# Altium schematic sheet ADC.SchDoc
size A3; Author: Jean Callus; Engineer: Jean Callus; Organization: RATON; Revision: 0; SheetNumber: 2
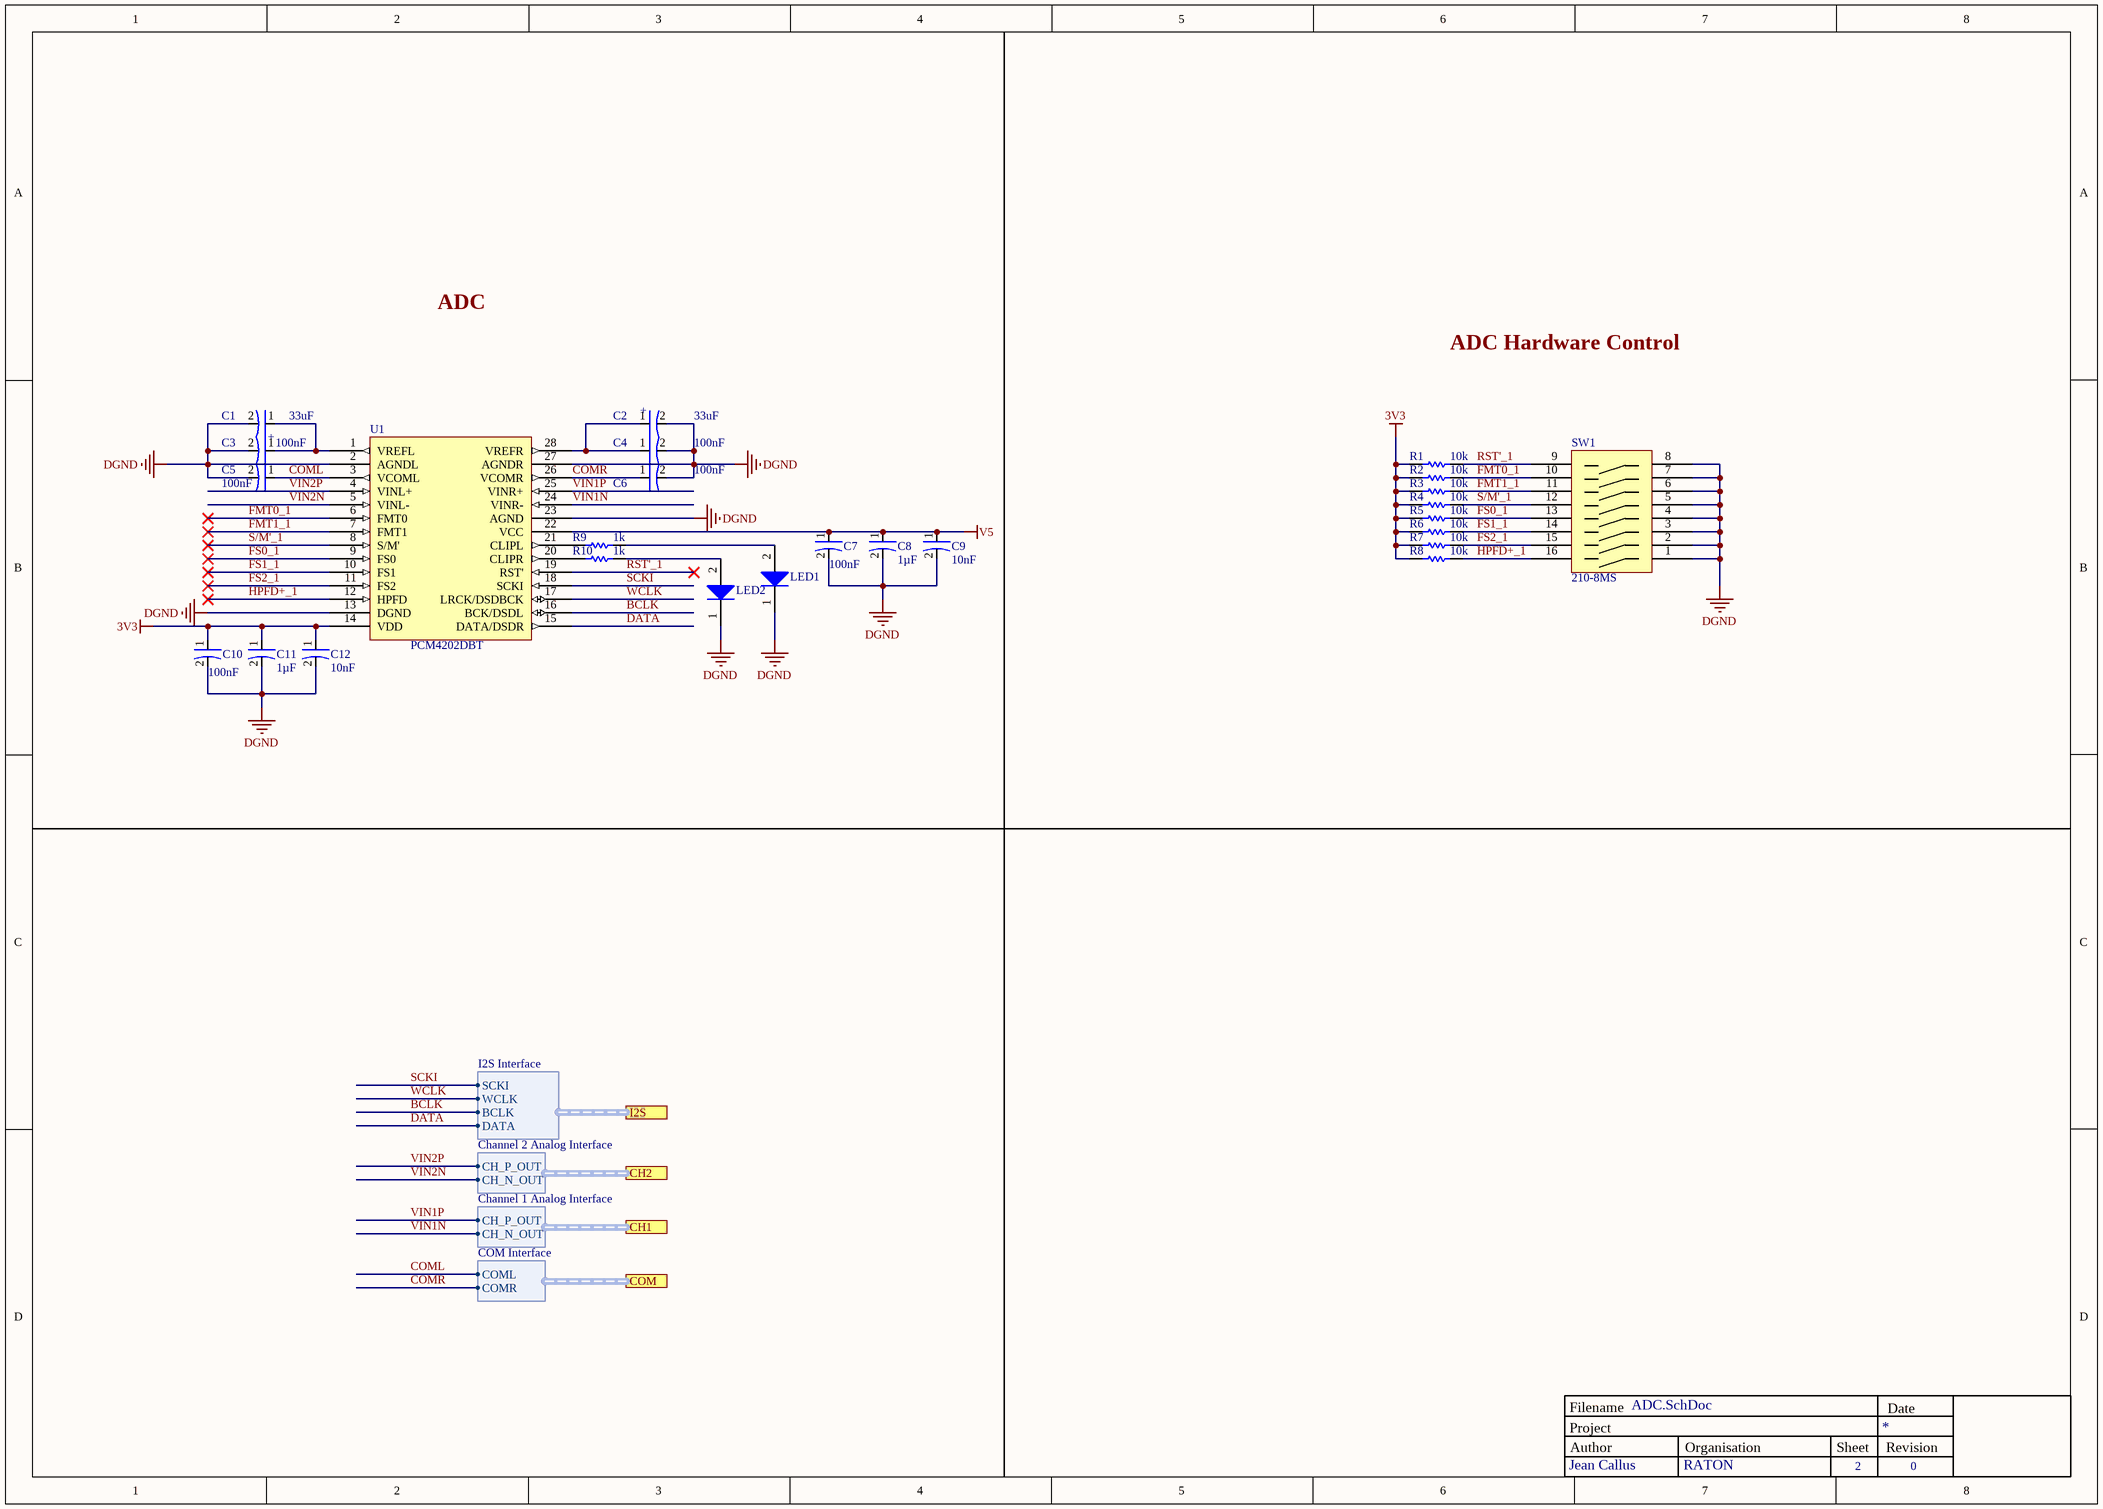
[diagram p0: ADC.SchDoc]

## Parts
C1  value 33uF  [CAPMP6032X26N]  (hidden comment: CAP 33uF TANT C)
C2  value 33uF  [CAPMP6032X26N]  (hidden comment: CAP 33uF TANT C)
C3  value 100nF  [0805-M]  (hidden comment: CAP 0.1uF CER 0805 50V  X7R 5%)
C4  value 100nF  [0805-M]  (hidden comment: CAP 0.1uF CER 0805 50V  X7R 5%)
C5  value 100nF  [0805-M]  (hidden comment: CAP 0.1uF CER 0805 50V  X7R 5%)
C6  value 100nF  [0805-M]  (hidden comment: CAP 0.1uF CER 0805 50V  X7R 5%)
C7  value 100nF  [0805-M]  (hidden comment: CAP 0.1uF CER 0805 50V  X7R 5%)
C8  value 1µF  [0805-L]  (hidden comment: CAP 1uF CER 0805 50V X7R 10%)
C9  value 10nF  [0805-M]  (hidden comment: CAP 10nF CER 0805 50V X7R 10%)
C10  value 100nF  [0805-M]  (hidden comment: CAP 0.1uF CER 0805 50V  X7R 5%)
C11  value 1µF  [0805-L]  (hidden comment: CAP 1uF CER 0805 50V X7R 10%)
C12  value 10nF  [0805-M]  (hidden comment: CAP 10nF CER 0805 50V X7R 10%)
LED1  LED 0603 Red 20mA 1.7V  [0603 Generic]  (value not drawn)
LED2  LED 0603 Red 20mA 1.7V  [0603 Generic]  (value not drawn)
R1  value 10k  [0805-M]  (hidden comment: RES 10k 0805 125mW 1%)
R2  value 10k  [0805-M]  (hidden comment: RES 10k 0805 125mW 1%)
R3  value 10k  [0805-M]  (hidden comment: RES 10k 0805 125mW 1%)
R4  value 10k  [0805-M]  (hidden comment: RES 10k 0805 125mW 1%)
R5  value 10k  [0805-M]  (hidden comment: RES 10k 0805 125mW 1%)
R6  value 10k  [0805-M]  (hidden comment: RES 10k 0805 125mW 1%)
R7  value 10k  [0805-M]  (hidden comment: RES 10k 0805 125mW 1%)
R8  value 10k  [0805-M]  (hidden comment: RES 10k 0805 125mW 1%)
R9  value 1k  [0805-M]  (hidden comment: RES 1k 0805 125mW 5%)
R10  value 1k  [0805-M]  (hidden comment: RES 1k 0805 125mW 5%)
SW1  210-8MS  [210-8MS]
U1  PCM4202DBT  [SOP65P780X200-28N]

## Ports
CH1 (harness Channel 1 Analog Interface), CH2 (harness Channel 2 Analog Interface), COM (harness COM Interface), I2S (harness I2S Interface)

## Harnesses
I2S Interface: SCKI, WCLK, BCLK, DATA
Channel 2 Analog Interface: CH_P_OUT, CH_N_OUT
Channel 1 Analog Interface: CH_N_OUT, CH_P_OUT
COM Interface: COML, COMR

## Nets
3V3: C10.1(Anode) C11.1(Anode) C12.1(Anode) R1.2 R2.2 R3.2 R4.2 R5.2 R6.2 R7.2 R8.2 U1.14(VDD)
DGND: C1.2(Cathode) C2.2(Cathode) C3.2(Cathode) C4.2(Cathode) C5.2(Cathode) C6.2(Cathode) C7.2(Cathode) C8.2(Cathode) C9.2(Cathode) C10.2(Cathode) C11.2(Cathode) C12.2(Cathode) LED1.1 LED2.1 SW1.1(SW1) SW1.2(SW2) SW1.3(SW3) SW1.4(SW4) SW1.5(SW1) SW1.6(SW2) SW1.7 SW1.8(SW4) U1.2(AGNDL) U1.13(DGND) U1.23(AGND) U1.27(AGNDR)
V5: C7.1(Anode) C8.1(Anode) C9.1(Anode) U1.22(VCC)
BCLK: U1.16(BCK/DSDL) ; port I2S.BCLK
COML: C5.1(Anode) U1.3(VCOML) ; port COM.COML
COMR: C6.1(Anode) U1.26(VCOMR) ; port COM.COMR
DATA: U1.15(DATA/DSDR) ; port I2S.DATA
FMT0_1: R2.1 SW1.10(SW3.in) U1.6(FMT0)
FMT1_1: R3.1 SW1.11(SW2.in) U1.7(FMT1)
FS0_1: R5.1 SW1.13(SW4.in) U1.9(FS0)
FS1_1: R6.1 SW1.14(SW3.in) U1.10(FS1)
FS2_1: R7.1 SW1.15(SW2.in) U1.11(FS2)
HPFD+_1: R8.1 SW1.16(SW1) U1.12(HPFD)
RST'_1: R1.1 SW1.9(SW4.in) U1.19(RST')
S/M'_1: R4.1 SW1.12(SW1.in) U1.8(S/M')
SCKI: U1.18(SCKI) ; port I2S.SCKI
VIN1N: U1.24(VINR-) ; port CH1.CH_N_OUT
VIN1P: U1.25(VINR+) ; port CH1.CH_P_OUT
VIN2N: U1.5(VINL-) ; port CH2.CH_N_OUT
VIN2P: U1.4(VINL+) ; port CH2.CH_P_OUT
WCLK: U1.17(LRCK/DSDBCK) ; port I2S.WCLK
NetC1_1: C1.1(Anode) C3.1(Anode) U1.1(VREFL)
NetC2_1: C2.1(Anode) C4.1(Anode) U1.28(VREFR)
NetLED1_2: LED1.2 R9.2
NetLED2_2: LED2.2 R10.2
NetR9_1: R9.1 U1.21(CLIPL)
NetR10_1: R10.1 U1.20(CLIPR)

## Notes on the sheet
- ADC
- ADC Hardware Control
- Project
- Filename
- Author
- Organisation
- Sheet
- Revision
- Date
  Date
- (in symbol CMP-001-00003-2) +

## Library data of the parts
C1 C2 = CMP-001-00003-2: CAP-33uF-TANT-C; Manufacturer: AVX; Type: SMD; Case/Package: C; Supplier 1: Mouser; ComponentLink1Description: Cap 33uF TANT C; Supplier Part Number: 581-TAJC336K016RNJV; ComponentLink1URL: https://eu.mouser.com/ProductDetail/AVX/TAJC336K016RNJV?qs=YCa%2FAAYMW0021Wdor8g%2FvQ%3D%3D
C3-C7 C10 = CAP 0.1uF CER 0805 50V  X7R 5%-2: CAP-0.1uF-CER-0805-50V- X7R-5%; Manufacturer: Generic; Bin: F1-C6-4; Type: SMD; Design Item ID: CAP 0.1uF CER 0805 50V  X7R 5%; Supplier 1: Mouser; Datasheet: http://www.kemet.com/Lists/ProductCatalog/Attachments/53/KEM_C1002_X7R_SMD.pdf; Source: Capacitor Library.SchLib; Case/Package: 0805; Status: Active; Supplier Part Number 1: 80-C0805C104J3R
C8 C11 = CAP 1uF CER 0805 50V X7R 10%-2: CAP-1uF-CER-0805-50V-X7R-10%; Manufacturer: Generic; Type: SMD; Bin: F1-C1-05; Supplier Part Number 1: 963-UMK212B7105KG-T; Supplier 1: Mouser; Case/Package: 0805; Source: Capacitor Library.SchLib; Design Item ID: CAP 1uF CER 0805 50V X7R 10%; Status: Active
C9 C12 = CAP 10nF CER 0805 50V X7R 10%-2: CAP-10nF-CER-0805-50V-X7R-10%; Manufacturer: Generic; Type: SMD; Bin: F1-C8-4; Design Item ID: CAP 10nF CER 0805 50V X7R 10%; Supplier 1: Mouser; Case/Package: 0805; Supplier Part Number 1: 81-GRM40X103K50D; Source: Capacitor Library.SchLib
LED1 LED2 = LED 0603 Red 20mA 1.7V-1: LED-0603-Red-20mA-1.7V-STOCK; Manufacturer: Generic; Bin: F2-DM1-2; Type: SMD; Supplier Part Number 1: 67-1551-6-ND; Design Item ID: LED 0603 Red 20mA 1.7V; Status: Active; Case/Package: 0603; Source: Diode Library.SchLib; Supplier 1: Digi-Key
R1-R8 = RES 10k 0805 125mW 1%-1: RES-10k-0805-125mW-1%; Manufacturer: Generic; MAPPING: 1(2,1,10k); Bin: F1-R12-10; Design Item ID: RES 10k 0805 125mW 1%; Case/Package: 0805; Type: SMD; Status: Active; Source: Resistor Library.SchLib
R9 R10 = RES 1k 0805 125mW 5%-1: RES-1k-0805-125mW-5%; Manufacturer: Generic; Bin: F1-R12-6; MAPPING: 1(2,1,30.9k); Design Item ID: RES 1k 0805 125mW 5%; Case/Package: 0805; Status: Active; Source: Resistor Library.SchLib; Type: SMD
SW1 = 210-8MS-2: SWITCH DIP SMD SPST 8 100mA 50V; Manufacturer: C&K Components; Supplier Part Number 1: 774-2108MS; Design Item ID: 210-8MS; Source: Switches Library.SchLib; Case/Package: 16 PDIP; Supplier 1: Mouser; Status: Active; Type: TH
U1 = CMP-019-00000-3: Analogue to Digital Converter, Dual, 24 bit, 216 kSPS, Single, 4.75 V, 5.25 V, SSOP ;RoHS Compliant: Yes; Number of A/D Converters: 2; Polarity: Bipolar; Power Dissipation: 408mW; Operating Supply Voltage: 5V; Conversion Rate: 216KS/s; Min Supply Voltage: 4.75V; Resolution: 24b; Number of Analog Inputs: 1; Number of DAC Channels: 0; Interface: Serial; Supply Type: Analog,Digital; Max Supply Voltage: 5.25V; Nominal Supply Current: 55mA; Number of Bits: 24; Power Consumption: 338mW; Case/Package: SSOP; Length: 10.2mm; Width: 5.3mm; Number of Pins: 28; Mount: Surface Mount; Height: 1.95mm; REACH SVHC: No SVHC; Lead Free: Lead Free; Min Operating Temperature: -10°C; Weight: 0.008529oz; Sampling Rate: 216KS/s; Package Quantity: 250; Number of ADC Channels: 2; Number of Elements: 2; Radiation Hardening: No; Max Power Dissipation: 408mW; Max Operating Temperature: 70°C; Number of Converters: 2; Packaging: Tape and Reel